# EAGLE schematic module (EAGLE 7.7.0)
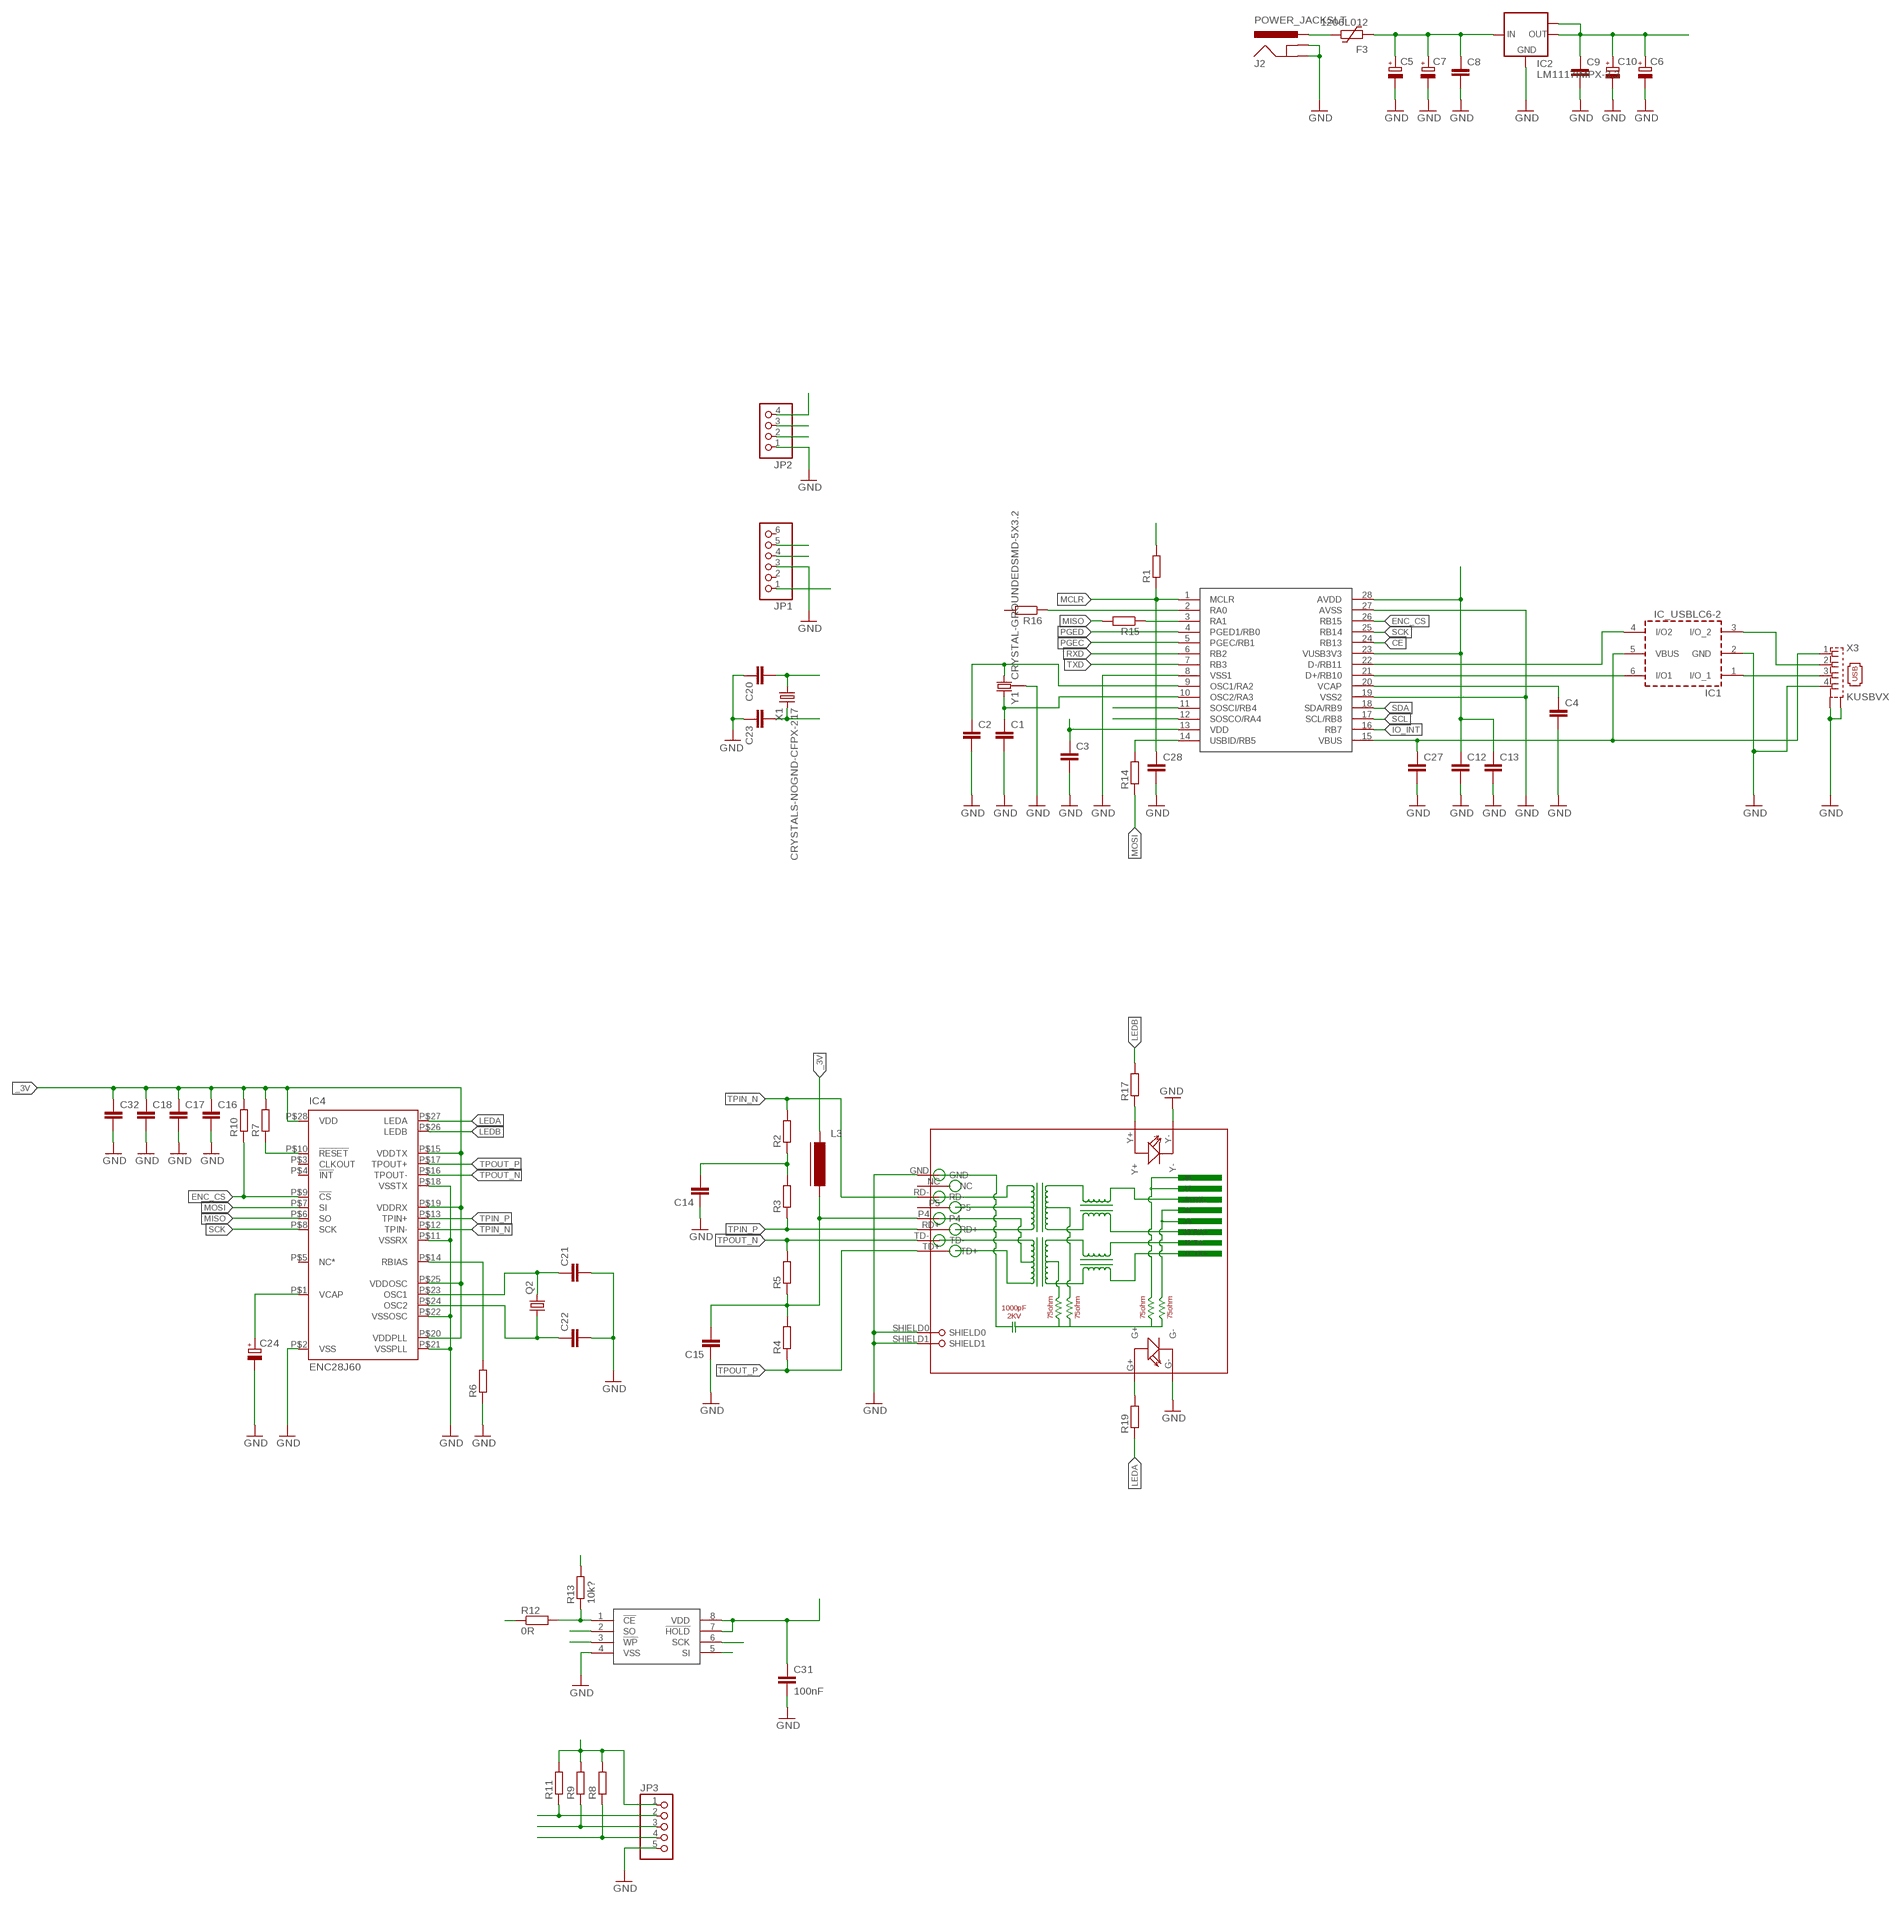
[diagram p0: schematic, sheet 1]

## Parts
C1  C-EUC0603  [C0603]
C2  C-EUC0603  [C0603]
C3  C-EUC0402  [C0402]
C4  C-EUC0603  [C0603]
C5  CPOL-EUSMCA  [SMC_A]
C6  CPOL-EUSMCA  [SMC_A]
C7  CPOL-EUSMCC  [SMC_C]
C8  C-EUC0603  [C0603]
C9  C-EUC0603  [C0603]
C10  CPOL-EUSMCB  [SMC_B]
C12  C-EUC0402  [C0402]
C13  C-EUC0603  [C0603]
C14  C-EUC0603  [C0603]
C15  C-EUC0603  [C0603]
C16  C-EUC0402  [C0402]
C17  C-EUC0603  [C0603]
C18  C-EUC0603  [C0603]
C20  C-EUC0603  [C0603]
C21  C-EUC0603  [C0603]
C22  C-EUC0603  [C0603]
C23  C-EUC0603  [C0603]
C24  CPOL-EUSMCA  [SMC_A]
C27  C-EUC0603  [C0603]
C28  C-EUC0603  [C0603]
C31  100nF  C-EUC0603  [C0603]
C32  C-EUC0402  [C0402]
F3  1206L012  [1206L]
IC1  IC_USBLC6-2  [SOT-23-6L]
IC2  LM1117IMPX-3.3  [SOT223]
IC4  ENC28J60  [TSSOP28W]
J2  POWER_JACKSLT  [POWER_JACK_SLOT]
JP1  PINHD-1X6  [1X06]
JP2  PINHD-1X4  [1X04]
JP3  PINHD-1X5  [1X05]
L3  FERRITE-0805  [FB805]
Q2  CRYSTALHC49S  [HC49/S]
R1  R-EU_R0603  [R0603]
R2  R-EU_R0603  [R0603]
R3  R-EU_R0603  [R0603]
R4  R-EU_R0603  [R0603]
R5  R-EU_R0603  [R0603]
R6  R-EU_R0805  [R0805]
R7  R-EU_R0603  [R0603]
R8  R-EU_R0402  [R0402]
R9  R-EU_R0402  [R0402]
R10  R-EU_R0603  [R0603]
R11  R-EU_R0402  [R0402]
R12  0R  R-EU_R0603  [R0603]
R13  10k?  R-EU_R0603  [R0603]
R14  R-EU_R0603  [R0603]
R15  R-EU_R0603  [R0603]
R16  R-EU_R1206  [R1206]
R17  R-EU_R1206  [R1206]
R19  R-EU_R1206  [R1206]
RJ1  HR911105A  [HR911105A]
U$1  PIC32MX250F128B2  [SSOP28]
U$2  SST25VF016BSO8M  [SO-08M]
X1  CRYSTALS-NOGND-CFPX-217  [3.2X1.5-2-PAD]
X3  KUSBVX  [KUSBVX]
Y1  CRYSTAL-GROUNDEDSMD-5X3.2  [CRYSTAL-SMD-5X3.2-4PAD]

## Nets
_3V: C3.1 C6.+ C9.1 C10.+ C12.1 C13.1 C16.1 C17.1 C18.1 C31.1 C32.1 IC2.2(OUT) IC2.TAB(OUT1) IC4.P$15(VDDTX) IC4.P$19(VDDRX) IC4.P$20(VDDPLL) IC4.P$25(VDDOSC) IC4.P$28(VDD) JP2.4 JP3.1 L3.1 R1.2 R7.2 R8.2 R9.2 R10.2 R11.2 R13.2 U$1.13(VDD) U$1.23(VUSB3V3) U$1.28(AVDD) U$2.3(!WP) U$2.7(!HOLD) U$2.8(VDD)
CE: R12.1 U$1.24(RB13)
CE1: R12.2 R13.1 U$2.1(!CE)
D_N: IC1.4(I/O2) U$1.22(D-/RB11)
D_P: IC1.6(I/O1) U$1.21(D+/RB10)
ENC_CS: IC4.P$9(!CS) R10.1 U$1.26(RB15)
ENC_RST: IC4.P$10(!RESET) R7.1
GND: C1.2 C2.2 C3.2 C4.2 C5.- C6.- C7.- C8.2 C9.2 C10.- C12.2 C13.2 C14.1 C15.1 C16.2 C17.2 C18.2 C20.1 C21.2 C22.2 C23.1 C24.- C27.2 C28.2 C31.2 C32.2 IC1.2(GND) IC2.1(GND) IC4.P$2(VSS) IC4.P$11(VSSRX) IC4.P$18(VSSTX) IC4.P$21(VSSPLL) IC4.P$22(VSSOSC) J2.GND@1(GNDBREAK) J2.GND@2(GND) JP1.3 JP2.1 JP3.5 R6.1 RJ1.G- RJ1.GND RJ1.SHIELD0 RJ1.SHIELD1 RJ1.Y- U$1.8(VSS1) U$1.19(VSS2) U$1.27(AVSS) U$2.4(VSS) X3.4 X3.M1(S1) X3.M2(S2) Y1.2 Y1.4
IO_INT: JP3.4 R8.1 U$1.16(RB7)
LEDA: IC4.P$27(LEDA) R19.1
LEDB: IC4.P$26(LEDB) R17.2
MCLR: C28.1 JP1.1 R1.1 U$1.1(MCLR)
MISO: IC4.P$6(SO) R15.2 U$2.2(SO)
MOSI: IC4.P$7(SI) R14.1 U$2.5(SI)
N$2: C14.2 R2.1 R3.2
N$6: C15.2 L3.2 R4.2 R5.1 RJ1.P4
N$7: C4.1 U$1.20(VCAP)
N$9: IC1.1(I/O_1) X3.3
N$10: IC1.3(I/O_2) X3.2
N$12: IC4.P$14(RBIAS) R6.2
N$13: R14.2 U$1.14(USBID/RB5)
N$14: F3.1 J2.PWR
N$15: R15.1 U$1.3(RA1)
N$16: R16.1 U$1.2(RA0)
N$17: C1.1 U$1.10(OSC2/RA3) Y1.3
N$18: C2.1 U$1.9(OSC1/RA2) Y1.1
N$22: C21.1 IC4.P$23(OSC1) Q2.2
N$23: C22.1 IC4.P$24(OSC2) Q2.1
N$29: C24.+ IC4.P$1(VCAP)
N$30: R17.1 RJ1.Y+
N$31: R19.2 RJ1.G+
PGEC: JP1.5 U$1.5(PGEC/RB1)
PGED: JP1.4 U$1.4(PGED1/RB0)
RXD: JP2.3 U$1.6(RB2)
SCK: IC4.P$8(SCK) U$1.25(RB14) U$2.6(SCK)
SCL: JP3.3 R9.1 U$1.17(SCL/RB8)
SDA: JP3.2 R11.1 U$1.18(SDA/RB9)
SOSCI: C20.2 U$1.11(SOSCI/RB4) X1.1
SOSCO: C23.2 U$1.12(SOSCO/RA4) X1.2
TPIN_N: IC4.P$12(TPIN-) R2.2 RJ1.RD-
TPIN_P: IC4.P$13(TPIN+) R3.1 RJ1.RD+
TPOUT_N: IC4.P$16(TPOUT-) R5.2 RJ1.TD-
TPOUT_P: IC4.P$17(TPOUT+) R4.1 RJ1.TD+
TXD: JP2.2 U$1.7(RB3)
VBUS: C5.+ C7.+ C8.1 C27.1 F3.2 IC1.5(VBUS) IC2.3(IN) U$1.15(VBUS) X3.1
Unconnected: IC4.P$3(CLKOUT) IC4.P$4(!INT) IC4.P$5(NC*) JP1.2 JP1.6 R16.2 RJ1.NC RJ1.P5

## Library data of the parts
C1-C4 C8 C9 C12-C18 C20-C23 C27 C28 C31 C32 = rcl:C-EU: CAPACITOR, European symbol
C5-C7 C10 C24 = rcl:CPOL-EU: POLARIZED CAPACITOR, European symbol
F3 = polyfuse-smd_10:?: Polyfuse Resettable PTC Source: http://www.littelfuse.com/products/resettable-ptcs.aspx; MF: Littelfuse; MPN: 1206L012; OC_FARNELL: 1596988; OC_NEWARK: 05M2298
IC1 = dp_devices:IC_USBLC6-2
IC2 = lm1117:LM1117IMPX-*
IC4 = microchip:ENC28J60: Stand-Alone Ethernet Controller with SPI Interface Source: http://ww1.microchip.com/downloads/en/DeviceDoc/39662c.pdf
J2 = SparkFun-Connectors:POWER_JACK: Power Jack This is the standard 5.5mm barrel jack for power. The PTH is the most common, proven, reliable, footprint. The Slot footprint only works if the mill layer is transmitted to the PCB fab house so be warned. Mating wall wart : TOL-00298 (and others); PROD_ID: PRT-00119
JP1 = pinhead:PINHD-1X6: PIN HEADER
JP2 = pinhead:PINHD-1X4: PIN HEADER
JP3 = pinhead:PINHD-1X5: PIN HEADER
L3 = dp_devices:FERRITE: Ferrite bead in various packages
Q2 = crystal:CRYSTAL: CRYSTAL; OC_FARNELL: 1667008; OC_NEWARK: unknown
R1-R17 R19 = rcl:R-EU_: RESISTOR, European symbol
RJ1 = hanrun:HR911105A
U$1 = microchip-pic32mx:PIC32MX250F128B
U$2 = mw:SST25VF016B
X1 = IQD-Frequency-Products:CRYSTALS-NOGND: CRYSTALS CAN NOT GROUNDED
X3 = con-kycon:KUSBVX: Vertical,Top Entry Universal Serial Bus Connector KUSBVX Series Source: KYCON Sibalco USB vertical socket KUSBV.pdf
Y1 = SparkFun-Clocks:CRYSTAL-GROUNDED: Crystals w/ Ground Pin (Generic) These are passive quartz crystals, which can be used as a clock source for a microcontroller. Crystal's are usually two-terminal devices. A third terminal may be optionally connected to ground, as recommended by the manufaturer.